# Altium project Motion_Board_V2.PrjPcb
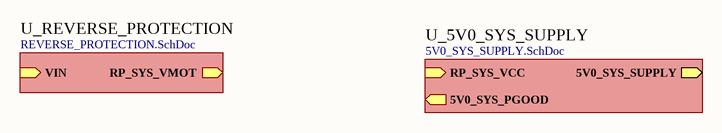
[diagram p0: MotionBoard_V2.SchDoc]
3 sheets, 32 parts. Net scope: hierarchical (ports join the sheet entries above them; power ports are global).
Sheets:
  MotionBoard_V2.SchDoc
    U_REVERSE_PROTECTION = REVERSE_PROTECTION.SchDoc
    U_5V0_SYS_SUPPLY = 5V0_SYS_SUPPLY.SchDoc

## Sheet MotionBoard_V2.SchDoc
size A3; SheetNumber: 1; SheetTotal: 2

### Sub-sheets
U_5V0_SYS_SUPPLY = 5V0_SYS_SUPPLY.SchDoc: 5V0_SYS_SUPPLY (out), 5V0_SYS_PGOOD (out), RP_SYS_VCC (in)
U_REVERSE_PROTECTION = REVERSE_PROTECTION.SchDoc: VIN (in), RP_SYS_VMOT (out)

## Sheet REVERSE_PROTECTION.SchDoc
size A4; SheetNumber: 2; SheetTotal: 3
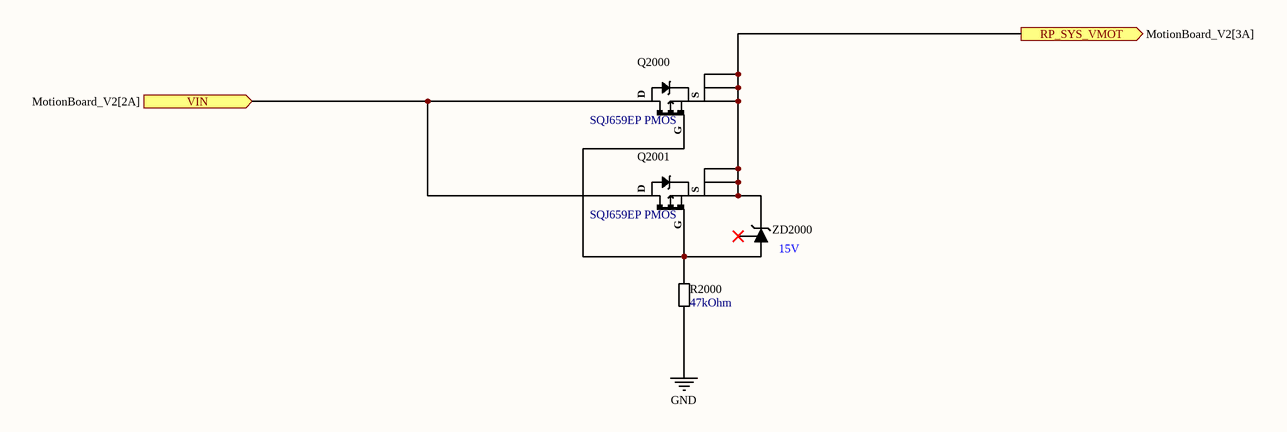
[diagram p1: REVERSE_PROTECTION.SchDoc]

### Parts
Q2000  SQJ659EP PMOS  [PowerPAK SO-8L SINGLE]
Q2001  SQJ659EP PMOS  [PowerPAK SO-8L SINGLE]
R2000  47kOhm  [RES_0603]
ZD2000  DZ23C15-E3-08 Zener Diode  [SOT95P245X96-3N]  (value not drawn)

### Ports
RP_SYS_VMOT (out, see MotionBoard_V2[3A]), VIN (in, see MotionBoard_V2[2A])

### Nets
GND: R2000.1
NetQ2000_D: Q2000.D Q2001.D ; port VIN
NetQ2000_G: Q2000.G Q2001.G R2000.2 ZD2000.1(Anode)
NetQ2000_S: Q2000.S(S1) Q2001.S(S1) ZD2000.3(Cathode) ; port RP_SYS_VMOT

Not connected (* = marked no-connect by the designer): ZD2000 2(Anode)*

### Notes on the sheet
- (near ZD2000) 15V

### Library data of the parts
Q2000 Q2001 = 00000005: P-Channel 60 V 52A (Tc) 83W (Tc) Surface Mount PowerPAK® SO-8; DigiKey Part Number: SQJ459EP-T1_GE3CT-ND; Mouser Part Number: 78-SQJ459EP-T2_BE3; ComponentLink1Description: DigiKey; ComponentLink1URL: https://www.digikey.com/en/products/detail/vishay-siliconix/SQJ459EP-T1-GE3/6708881; ComponentLink2Description: Mouser; ComponentLink2URL: https://eu.mouser.com/ProductDetail/Vishay-Siliconix/SQJ459EP-T2_BE3?qs=CiayqK2gdcKpg8h0vLRPjA%3D%3D
R2000 = R000010: 47 kOhms ±1% 0.1W, 1/10W Chip Resistor 0603 (1608 Metric) Moisture Resistant Thick Film; ComponentLink1Description: DigiKey; ComponentLink1URL: https://www.digikey.com/en/products/detail/yageo/RC0603FR-0747KL/727253; resistance: 47kOhm; DigiKey Part Number: 311-47.0KHRCT-ND
ZD2000 = 00000006: Zener Diode Array 1 Pair Common Cathode 15 V 300 mW ±5% SOT-23-3; DigiKey Part Number: 112-DZ23C15-E3-08CT-ND; ComponentLink1Description: DigiKey; ComponentLink1URL: https://www.digikey.com/en/products/detail/vishay-general-semiconductor-diodes-division/DZ23C15-E3-08/4831460

## Sheet 5V0_SYS_SUPPLY.SchDoc
size OrCAD B; SheetNumber: 2; SheetTotal: 2
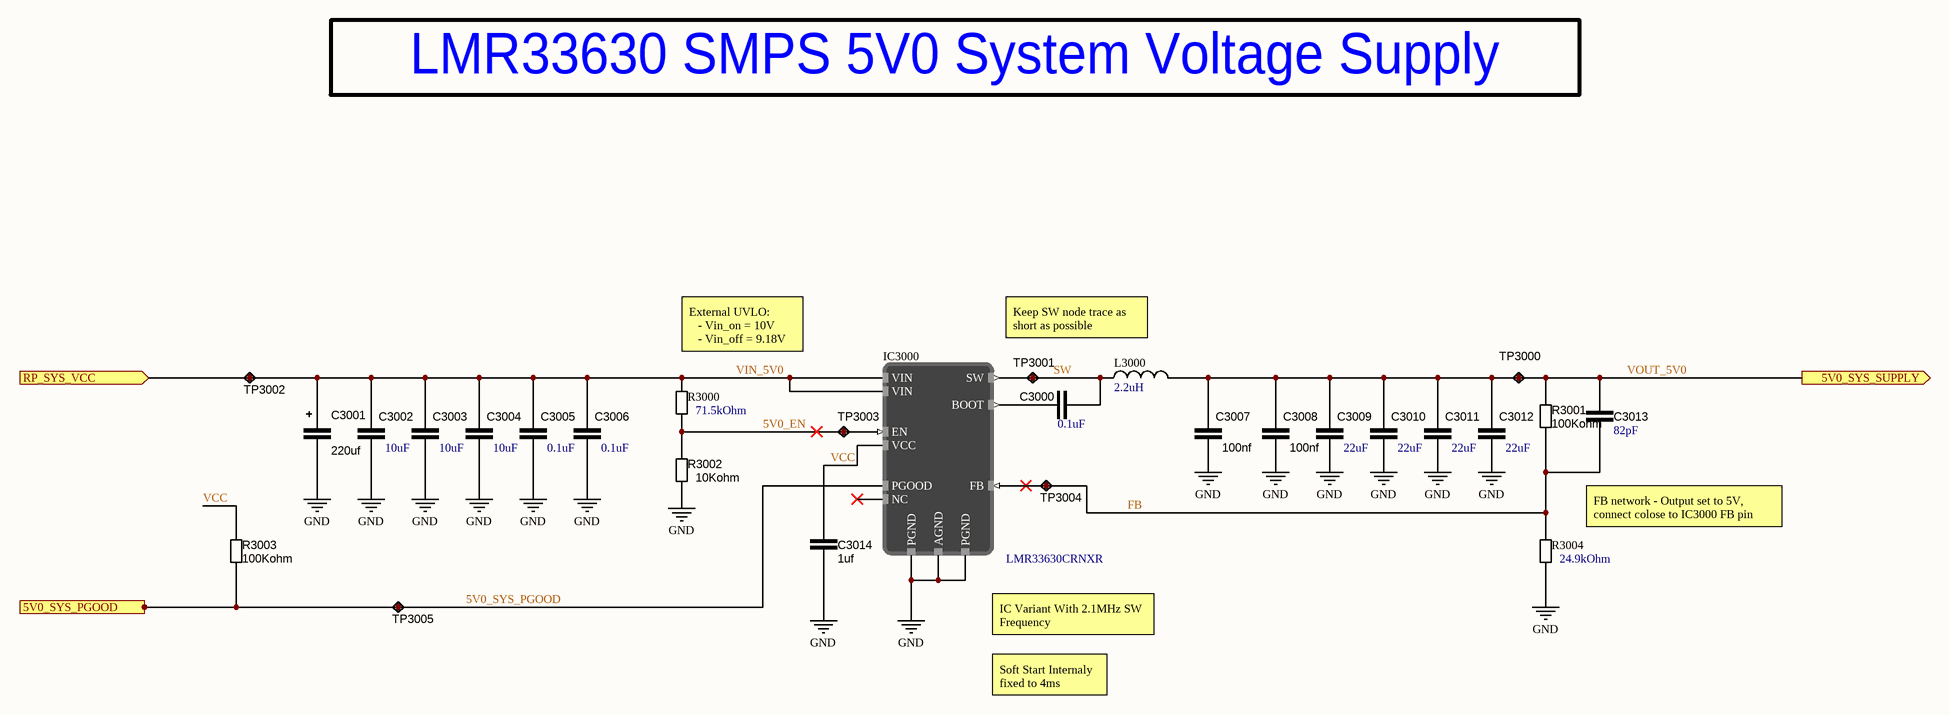
[diagram p2: 5V0_SYS_SUPPLY.SchDoc]

### Parts
C3000  0.1uF  [CAP_0603]
C3001  220uf  [CAPAE109103X103M]
C3002  10uF  [CAP_1206]
C3003  10uF  [CAP_1206]
C3004  10uF  [CAP_1206]
C3005  0.1uF  [CAP_0603]
C3006  0.1uF  [CAP_0603]
C3007  100nf  [CAP_0603]
C3008  100nf  [CAP_0603]
C3009  22uF  [CAP_1206]
C3010  22uF  [CAP_1206]
C3011  22uF  [CAP_1206]
C3012  22uF  [CAP_1206]
C3013  82pF  [CAP_0603]
C3014  1uf  [CAP_0603]
IC3000  LMR33630CRNXR  [VQFN-HR]
L3000  2.2uH  [INDP_518X518]
R3000  71.5kOhm  [RES_0603]
R3001  100Kohm  [RES_0603]
R3002  10Kohm  [RES_0603]
R3003  100Kohm  [RES_0603]
R3004  24.9kOhm  [RES_0603]
TP3000  Test point  [TestPoint]  (value not drawn)
TP3001  Test point  [TestPoint]  (value not drawn)
TP3002  Test point  [TestPoint]  (value not drawn)
TP3003  Test point  [TestPoint]  (value not drawn)
TP3004  Test point  [TestPoint]  (value not drawn)
TP3005  Test point  [TestPoint]  (value not drawn)

### Ports
5V0_SYS_PGOOD (out, see MotionBoard_V2[4A]), 5V0_SYS_SUPPLY (out, see MotionBoard_V2[4A]), RP_SYS_VCC (in, see MotionBoard_V2[4A])

### Nets
GND: C3001.1 C3002.1 C3003.1 C3004.1 C3005.1 C3006.1 C3007.1 C3008.1 C3009.1 C3010.1 C3011.1 C3012.1 C3014.1 IC3000.1(PGND) IC3000.6(AGND) IC3000.11(PGND) R3002.1 R3004.1
5V0_EN: IC3000.9(EN) R3000.1 R3002.2 TP3003.1  [project net 5V0_EN_2]
5V0_SYS_PGOOD: IC3000.8(PGOOD) R3003.1 TP3005.1 ; port 5V0_SYS_PGOOD
FB: C3013.1 IC3000.7(FB) R3001.1 R3004.2 TP3004.1  [project net FB_2]
SW: C3000.2 IC3000.12(SW) L3000.1 TP3001.1  [project net SW_2]
VCC: C3014.2 IC3000.5(VCC) R3003.2  [project net VCC_2]
VIN_5V0: C3001.2 C3002.2 C3003.2 C3004.2 C3005.2 C3006.2 IC3000.2(VIN) IC3000.10(VIN) R3000.2 TP3002.1 ; port RP_SYS_VCC
VOUT_5V0: C3007.2 C3008.2 C3009.2 C3010.2 C3011.2 C3012.2 C3013.2 L3000.2 R3001.2 TP3000.1 ; port 5V0_SYS_SUPPLY
NetC3000_1: C3000.1 IC3000.4(BOOT)

Not connected (* = marked no-connect by the designer): IC3000 3(NC)*

### Notes on the sheet
- LMR33630 SMPS 5V0 System Voltage Supply
- (near R3000) External UVLO:
  - Vin_on = 10V
  - Vin_off = 9.18V
- Keep SW node trace as short as possible
- FB network - Output set to 5V, connect colose to IC3000 FB pin
- (near IC3000) IC Variant With 2.1MHz SW Frequency
- Soft Start Internaly fixed to 4ms

### Library data of the parts
C3000 C3005 C3006 = C000018: CAP CER 0.1UF 50V X7R 0603; capacitance: 0.1uF; ComponentLink1Description: DigiKey; ComponentLink1URL: https://www.digikey.com/en/products/detail/samsung-electro-mechanics/CL10B104KB8NNNC/3886658; DigiKey Part Number: 1276-1000-1-ND
C3001 = C000019: CAP ALUM 220UF 20% 50V SMD; capaticanse: 220uf; ComponentLink1Description: digikey; ComponentLink1URL: https://www.digikey.com/en/products/detail/nichicon/UCW1H221MNL1GS/2549783; DigiKey part number: 493-9426-1-ND
C3002-C3004 = C000017: CAP CER 10UF 50V X7R 1206; capacitance: 10uF; ComponentLink1Description: DigiKey; ComponentLink1URL: https://www.digikey.com/en/products/detail/samsung-electro-mechanics/CL31B106KBHNNNE/5961251; DigiKey Part Number: 1276-6767-1-ND
C3007 C3008 = C000007: CAP CER 100nF 0603 25V X7R; capaticanse: 100nf; ComponentLink1Description: digikey; ComponentLink1URL: https://www.digikey.com/en/products/detail/kyocera-avx/06033C104K4T2A/8019250
C3009-C3012 = C000020: 22 µF ±10% 25V Ceramic Capacitor X5R 1206 (3216 Metric); capacitance: 22uF; ComponentLink1Description: DigiKey; ComponentLink1URL: https://www.digikey.com/en/products/detail/samsung-electro-mechanics/CL31A226KAHNNNE/3888705; DigiKey Part Number: 1276-3047-1-ND
C3013 = C000021: 82 pF ±1% 25V Ceramic Capacitor C0G, NP0 0603 (1608 Metric); capacitance: 82pF; ComponentLink1Description: DigiKey; ComponentLink1URL: https://www.digikey.com/en/products/detail/kyocera-avx/KGM15ACG1E820FT/1599315?s=N4IgjCBcoMxaBjKAzAhgGwM4FMA0IB7KAbXDBggF18AHAFyhAGU6AnASwDsBzEAX3xgALPBBJIaLHkIlwAVgCcAJiEB2ENRD1GLDj36CAbKPGSc%2BIpFIxlQ45u2RmbLrwEglABiEKTKDOYyViAAHEoABDQAYhq0DE4AqpzsdADyyACy2KiYAK6s2AYgALRKfpBsudKWpHIafA1AA; DigiKey Part Number: 478-KGM15ACG1E820FTCT-ND
C3014 = C000011: CAP CER 1uF 10V X7R 0603; capaticanse: 1uf; ComponentLink1Description: digikey; ComponentLink1URL: https://www.digikey.com/en/products/detail/samsung-electro-mechanics/CL10B105KP8NNNC/3887604; DigiKey part number: 1276-1946-2-ND
IC3000 = LMR33630CRNXR: Buck Switching Regulator IC Positive Adjustable 1V 1 Output 3A 12-PowerVFQFN; DigiKey Part Number: 296-49768-1-ND; ComponentLink1Description: DigiKey; ComponentLink1URL: https://www.digikey.com/en/products/detail/texas-instruments/LMR33630CRNXR/9356579; Mouser Part Number: 595-LMR33630CRNXR; ComponentLink2Description: Mouser; ComponentLink2URL: https://eu.mouser.com/ProductDetail/Texas-Instruments/LMR33630CRNXR?qs=55YtniHzbhDkvgzAIyvpfQ%3D%3D
L3000 = L000012: FIXED IND 2.2UH 4.2A 50.1MOHM SM; inductance: 2.2uH; DigiKey Part Number: 541-1088-1-ND; ComponentLink1Description: DigiKey; ComponentLink1URL: https://www.digikey.com/en/products/detail/vishay-dale/IHLP2020BZER2R2M01/1869311?s=N4IgTCBcDaIJIAkAyAFMAGDAhAWgUQCUwiBZdARhAF0BfIA
R3000 = R000022: 71.5 kOhms ±1% 0.1W, 1/10W Chip Resistor 0603 (1608 Metric) Moisture Resistant Thick Film; ComponentLink1Description: DigiKey; ComponentLink1URL: https://www.digikey.com/en/products/detail/yageo/RC0603FR-0771K5L/727370; resistance: 71.5kOhm; DigiKey Part Number: 311-71.5KHRCT-ND
R3001 R3003 = R000006: RES 100K OHM 1% 1/10W 0603; resistance: 100Kohm; ComponentLink1Description: digikey; ComponentLink1URL: https://www.digikey.com/en/products/detail/stackpole-electronics-inc/RMCF0603FG100K/1713543
R3002 = R000001: RES 10K OHM 1% 1/10W 0603; resistance: 10Kohm; ComponentLink1Description: digikey; ComponentLink1URL: https://www.digikey.com/en/products/detail/vishay-beyschlag-draloric-bc-components/MCT06030C1002FP500/1850440
R3004 = R000017: 24.9 kOhms ±1% 0.1W, 1/10W Chip Resistor 0603 (1608 Metric) Automotive AEC-Q200 Thick Film; ComponentLink1Description: DigiKey; ComponentLink1URL: https://www.digikey.com/en/products/detail/panasonic-electronic-components/ERJ-3EKF2492V/196236; resistance: 24.9kOhm; DigiKey Part Number: P24.9KHCT-ND
TP3000-TP3005 = TP002: Test point 1mm

## Nets that join several sheets
GND: REVERSE_PROTECTION (R2000.1), 5V0_SYS_SUPPLY (18 pins)